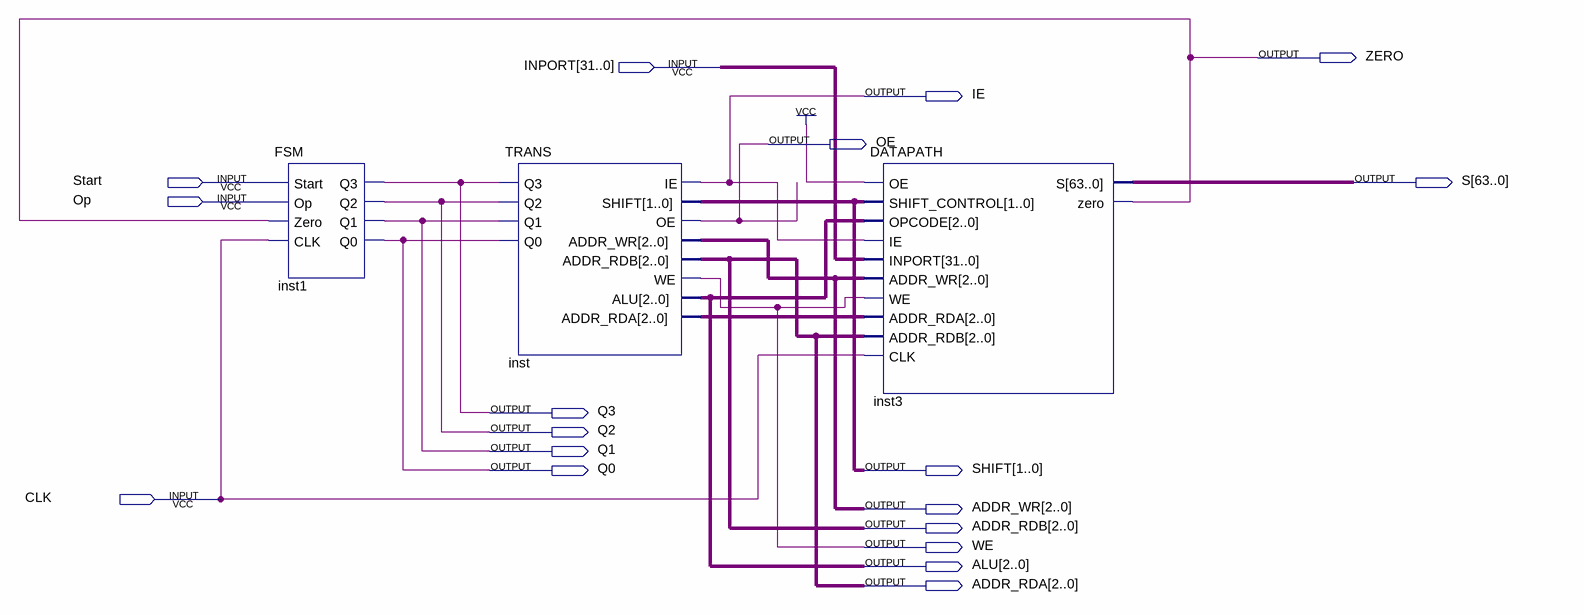
[diagram p0: schematic sheet]
// Quartus schematic TEST.bdf as structural Verilog: 3 symbols, 18 pins
module TEST (
  input  [31:0] INPORT,
  input  Start,
  input  Op,
  input  CLK,
  output ZERO,
  output IE,
  output OE,
  output [63:0] S,
  output Q3,
  output Q2,
  output Q1,
  output Q0,
  output [1:0] SHIFT,
  output [2:0] ADDR_WR,
  output [2:0] ADDR_RDB,
  output WE,
  output [2:0] ALU,
  output [2:0] ADDR_RDA
);

  wire [2:0] inst_addr_rda;

  FSM inst1 (.Start(Start), .Op(Op), .Zero(ZERO), .CLK(CLK), .Q3(Q3), .Q2(Q2), .Q1(Q1), .Q0(Q0));
  TRANS inst (
    .Q3(Q3), .Q2(Q2), .Q1(Q1), .Q0(Q0), .IE(IE), .SHIFT(SHIFT), .OE(OE), .ADDR_WR(ADDR_WR),
    .ADDR_RDB(ADDR_RDA), .WE(WE), .ALU(ALU), .ADDR_RDA(inst_addr_rda));
  DATAPATH inst3 (
    .OE(1'b1), .SHIFT_CONTROL(SHIFT), .OPCODE(ALU), .IE(IE), .INPORT(INPORT), .ADDR_WR(ADDR_WR), .WE(WE),
    .ADDR_RDA(inst_addr_rda), .ADDR_RDB(ADDR_RDA), .CLK(CLK), .S(S), .zero(ZERO));

  assign ADDR_RDB = ADDR_RDA;
endmodule
